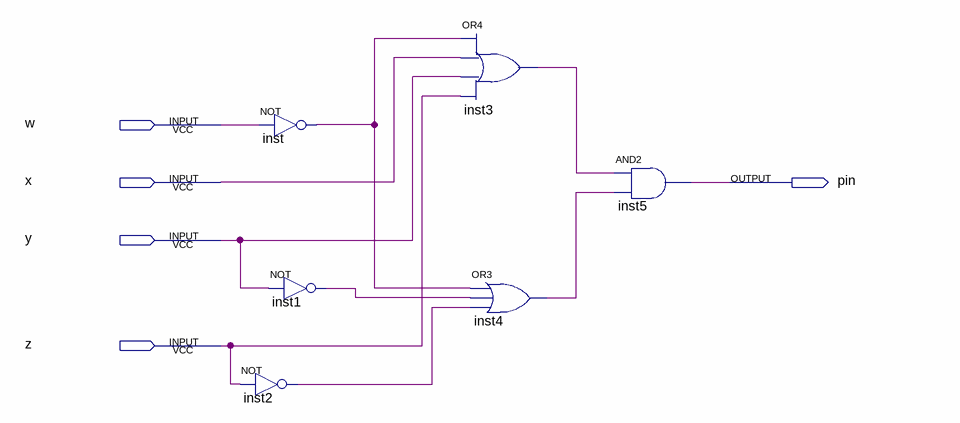
[diagram p0: schematic sheet]
// Quartus schematic OptimalWORKING.bdf as structural Verilog: 6 symbols, 5 pins
module OptimalWORKING (
  input  w,
  input  x,
  input  y,
  input  z,
  output pin
);

  wire inst1_out, inst2_out, inst3_out, inst4_out, inst_out;

  not inst2 (inst2_out, z);
  not inst (inst_out, w);
  not inst1 (inst1_out, y);
  or inst3 (inst3_out, inst_out, x, y, z);
  or inst4 (inst4_out, inst_out, inst1_out, inst2_out);
  and inst5 (pin, inst3_out, inst4_out);
endmodule
